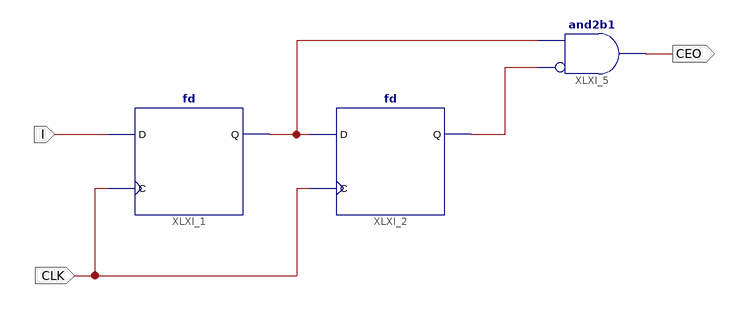
[diagram p0: schematic sheet 1]
// Xilinx ISE schematic edetect.sch (spartan6) as structural Verilog: 3 symbols, 3 ports
module edetect (
  input  I,
  input  CLK,
  output CEO
);

  wire XLXN_5, XLXN_6;

  fd XLXI_1 (.C(CLK), .D(I), .Q(XLXN_6));
  fd XLXI_2 (.C(CLK), .D(XLXN_6), .Q(XLXN_5));
  and XLXI_5 (CEO, ~XLXN_5, XLXN_6);  // and2b1
endmodule
